# Altium project utca-rtm-template.PrjPcb
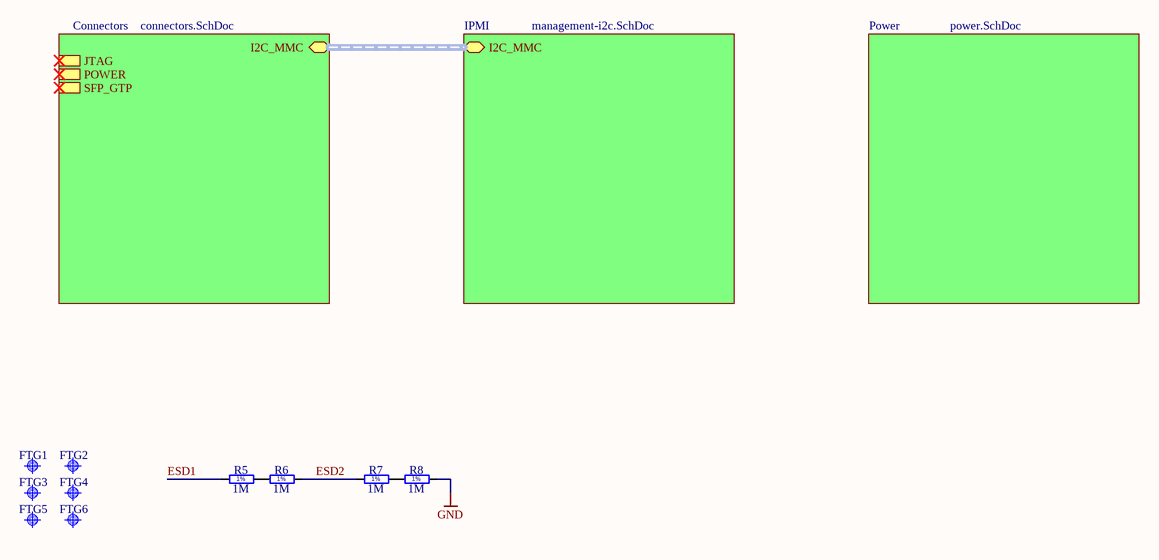
[diagram p0: rtm-top.SchDoc]
4 sheets, 37 parts. Net scope: hierarchical (ports join the sheet entries above them; power ports are global).
Board file: utca-rtm-template.PcbDoc
Sheets:
  rtm-top.SchDoc
    Connectors = connectors.SchDoc
    IPMI = management-i2c.SchDoc
    Power = power.SchDoc

## Sheet rtm-top.SchDoc
size A3

### Parts
FTG1  Use only in PCB  [FIDUCIAL_TOP_C100-200]  (value not drawn)
FTG2  Use only in PCB  [FIDUCIAL_TOP_C100-200]  (value not drawn)
FTG3  Use only in PCB  [FIDUCIAL_TOP_C100-200]  (value not drawn)
FTG4  Use only in PCB  [FIDUCIAL_TOP_C100-200]  (value not drawn)
FTG5  Use only in PCB  [FIDUCIAL_TOP_C100-200]  (value not drawn)
FTG6  Use only in PCB  [FIDUCIAL_TOP_C100-200]  (value not drawn)
R5  1M  [RESC3216X65N]
R6  1M  [RESC3216X65N]
R7  1M  [RESC3216X65N]
R8  1M  [RESC3216X65N]

### Sub-sheets
Connectors = connectors.SchDoc: I2C_MMC (bidir, harness I2C), JTAG (harness RTM_JTAG), POWER (harness POWER), SFP_GTP (harness SFP_GTP)
IPMI = management-i2c.SchDoc: I2C_MMC (bidir)
Power = power.SchDoc: no entries

### Nets
GND: R8.2
ESD1: R5.1
ESD2: R6.2 R7.1
NetR5_2: R5.2 R6.1
NetR7_2: R7.2 R8.1

### Buses and harness runs
harness sheet Connectors/I2C_MMC = sheet IPMI/I2C_MMC

### Notes on the sheet
- Title:
- Date:
- Project:
- Drawn by:
- Time:
- Revised by:
- Sheet
- of
- Grupo de diagnóstico do feixe -
  DIG - LNLS
- Copyright CNPEM 2020.
  This documentation describes Open Hardware and is licensed under the CERN OHL S v2. You may redistribute and modify this documentation under the terms of the CERN OHL S v2. (https://www.ohwr.org/cernohl). This documentation is distributed WITHOUT ANY EXPRESS OR IMPLIED WARRANTY, INCLUDING OF MERCHANTABILITY, SATISFACTORY QUALITY AND FITNESS FOR A PARTICULAR PURPOSE. Please see the CERN OHL S v2 for applicable conditions.
- File:
- (in symbol R1206_1M_1%_0.25W_100PPM) 1%

### Library data of the parts
FTG1-FTG6 = FIDUCIAL_TARGET_C100-200: Fiducial Target; Part Description: Round Fiducial Target, Top Layer, 1.0mm, Top Solder 2.0mm, Keepout =2.0mm; Mounted: No; Part Number: FIDUCIAL_TARGET_C100-200; Component Kind: Standard (No BOM); Component Type: Standard (No BOM); Pin Count: 1; Family: Fiducial; Socket: No; SMD: Yes; Sense: No; Status: None; ComponentHeight: 0mm; HelpURL: Undefined; Author: CERN DEM JLC; CreateDate: 09/02/2010; LatestRevisionDate: 04/04/2012; PackageDescription: Round Fiducial Target, Top Layer, 1.0mm, Top Solder 2.0mm, Keepout =2.0mm
R5-R8 = R1206_1M_1%_0.25W_100PPM: Resistor - 1%; Part Description: General Purpose Thick Film Chip Resistor; Manufacturer: GENERIC; Manufacturer1 Part Number: NRC12F1004TRF; Power: 0.25W; TC: ±100ppm/°C; Part Number: R1206_1M_1%_0.25W_100PPM; Component Kind: Standard; Component Type: Standard; Pin Count: 2; Value: 1M; Status: Preferred; Tolerance: ±1%; Manufacturer Part Number: R1206_1M_1%_0.25W_100PPM; Case: 1206; Mounted: Yes; Sense: No; Socket: No; SMD: Yes; Manufacturer1 Example: NIC COMPONENT; Manufacturer1 ComponentHeight: 0.65mm; HelpURL: \\cern.ch\dfs\Applications\Altium\Datasheets\R1206_NIC_NRC.pdf; Author: CERN DEM JLC; CreateDate: 03/12/2007; LatestRevisionDate: 13/03/2008

## Sheet connectors.SchDoc
size A3
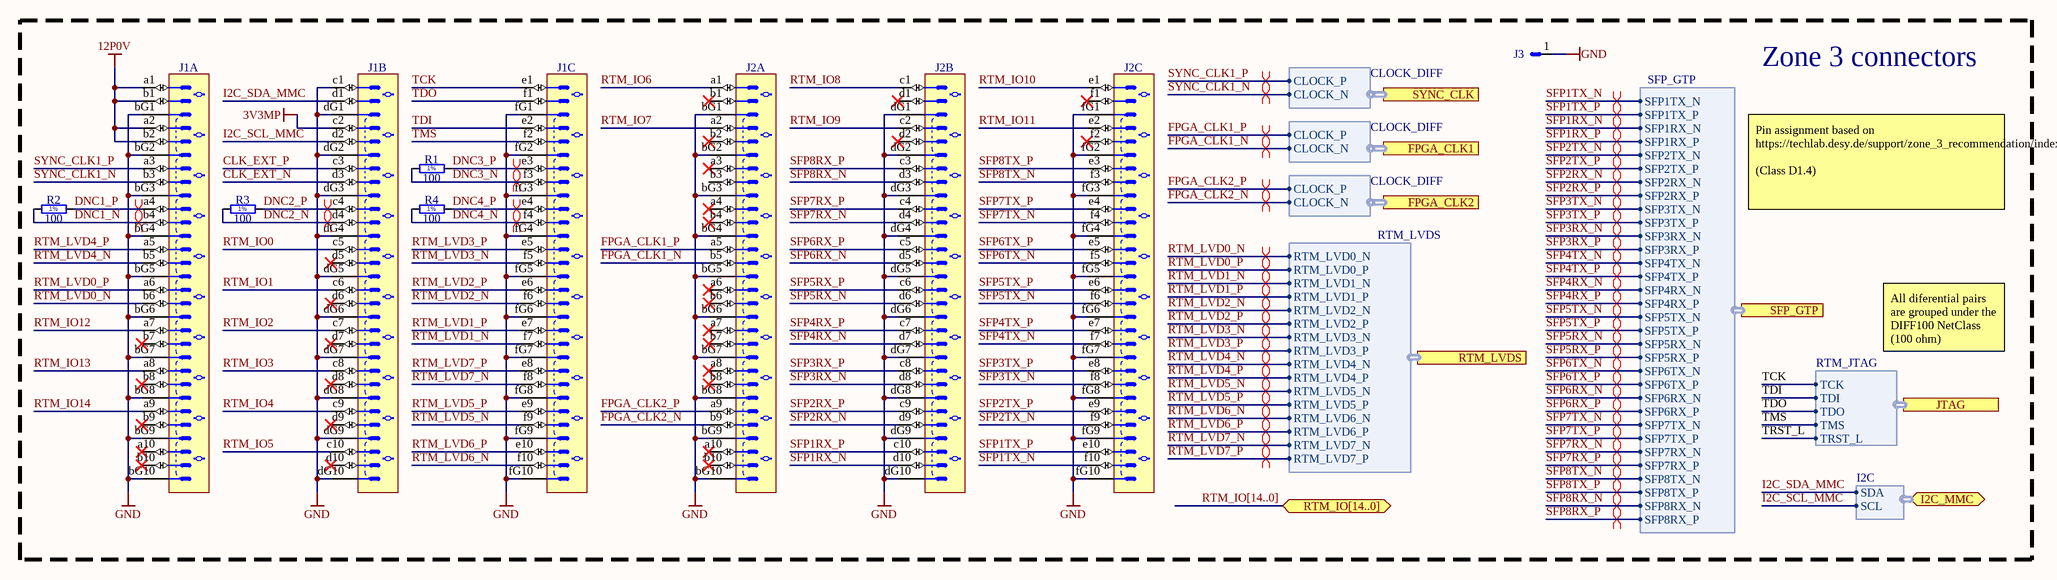
[diagram p1: connectors.SchDoc]

### Parts
J1  Advanced TCA  [TYCO_6469183-1]  (value not drawn)  (parts A,B,C of 3)
J2  Advanced TCA  [TYCO_6469183-1]  (value not drawn)  (parts A,B,C of 3)
J3  (no value)  [TYCO_1469265-1]
R1  100  [RESC1608X55N]
R2  100  [RESC1608X55N]
R3  100  [RESC1608X55N]
R4  100  [RESC1608X55N]

### Blocks framed on the sheet
Zone 3 connectors: J1-J3 R1-R4

### Ports
FPGA_CLK1 (harness CLOCK_DIFF), FPGA_CLK2 (harness CLOCK_DIFF), I2C_MMC (bidir, harness I2C), JTAG (harness RTM_JTAG), RTM_IO[14..0] (bidir, harness JTAG), RTM_LVDS (harness RTM_LVDS), SFP_GTP (harness SFP_GTP), SYNC_CLK (harness CLOCK_DIFF)

### Harnesses
RTM_LVDS: RTM_LVD0_N, RTM_LVD0_P, RTM_LVD1_N, RTM_LVD1_P, RTM_LVD2_N, RTM_LVD2_P, RTM_LVD3_N, RTM_LVD3_P, RTM_LVD4_N, RTM_LVD4_P, RTM_LVD5_N, RTM_LVD5_P, RTM_LVD6_N, RTM_LVD6_P, RTM_LVD7_N, RTM_LVD7_P
SFP_GTP: SFP1RX_N, SFP1RX_P, SFP1TX_N, SFP1TX_P, SFP2TX_N, SFP2TX_P, SFP2RX_N, SFP2RX_P, SFP3TX_N, SFP3TX_P, SFP3RX_N, SFP3RX_P, SFP4TX_N, SFP4TX_P, SFP4RX_N, SFP4RX_P, SFP5TX_N, SFP5TX_P, SFP5RX_N, SFP5RX_P, SFP6TX_N, SFP6TX_P, SFP6RX_N, SFP6RX_P, SFP7TX_N, SFP7TX_P, SFP7RX_N, SFP7RX_P, SFP8TX_N, SFP8TX_P, SFP8RX_N, SFP8RX_P
RTM_JTAG: TCK, TDI, TDO, TMS, TRST_L
CLOCK_DIFF: CLOCK_P, CLOCK_N
I2C: SDA, SCL

### Nets
3V3MP: J1.c2
12P0V: J1.a1 J1.a2 J1.b1 J1.b2
GND: J1.bG1 J1.bG2 J1.bG3 J1.bG4 J1.bG5 J1.bG6 J1.bG7 J1.bG8 J1.bG9 J1.bG10 J1.c1 J1.dG1 J1.dG2 J1.dG3 J1.dG4 J1.dG5 J1.dG6 J1.dG7 J1.dG8 J1.dG9 J1.dG10 J1.fG1 J1.fG2 J1.fG3 J1.fG4 J1.fG5 J1.fG6 J1.fG7 J1.fG8 J1.fG9 J1.fG10 J2.bG1 J2.bG2 J2.bG3 J2.bG4 J2.bG5 J2.bG6 J2.bG7 J2.bG8 J2.bG9 J2.bG10 J2.dG1 J2.dG2 J2.dG3 J2.dG4 J2.dG5 J2.dG6 J2.dG7 J2.dG8 J2.dG9 J2.dG10 J2.fG1 J2.fG2 J2.fG3 J2.fG4 J2.fG5 J2.fG6 J2.fG7 J2.fG8 J2.fG9 J2.fG10 J3.1
CLK_EXT_N: J1.d3
CLK_EXT_P: J1.c3
DNC1_N: J1.b4 R2.1
DNC1_P: J1.a4 R2.2
DNC2_N: J1.d4 R3.1
DNC2_P: J1.c4 R3.2
DNC3_N: J1.f3 R1.1
DNC3_P: J1.e3 R1.2
DNC4_N: J1.f4 R4.1
DNC4_P: J1.e4 R4.2
FPGA_CLK1_N: J2.b5 ; port FPGA_CLK1.CLOCK_N
FPGA_CLK1_P: J2.a5 ; port FPGA_CLK1.CLOCK_P
FPGA_CLK2_N: J2.b9 ; port FPGA_CLK2.CLOCK_N
FPGA_CLK2_P: J2.a9 ; port FPGA_CLK2.CLOCK_P
I2C_SCL_MMC: J1.d2 ; port I2C_MMC.SCL
I2C_SDA_MMC: J1.d1 ; port I2C_MMC.SDA
RTM_IO0: J1.c5
RTM_IO1: J1.c6
RTM_IO2: J1.c7
RTM_IO3: J1.c8
RTM_IO4: J1.c9
RTM_IO5: J1.c10
RTM_IO6: J2.a1
RTM_IO7: J2.a2
RTM_IO8: J2.c1
RTM_IO9: J2.c2
RTM_IO10: J2.e1
RTM_IO11: J2.e2
RTM_IO12: J1.a7
RTM_IO13: J1.a8
RTM_IO14: J1.a9
RTM_LVD0_N: J1.b6 ; port RTM_LVDS.RTM_LVD0_N
RTM_LVD0_P: J1.a6 ; port RTM_LVDS.RTM_LVD0_P
RTM_LVD1_N: J1.f7 ; port RTM_LVDS.RTM_LVD1_N
RTM_LVD1_P: J1.e7 ; port RTM_LVDS.RTM_LVD1_P
RTM_LVD2_N: J1.f6 ; port RTM_LVDS.RTM_LVD2_N
RTM_LVD2_P: J1.e6 ; port RTM_LVDS.RTM_LVD2_P
RTM_LVD3_N: J1.f5 ; port RTM_LVDS.RTM_LVD3_N
RTM_LVD3_P: J1.e5 ; port RTM_LVDS.RTM_LVD3_P
RTM_LVD4_N: J1.b5 ; port RTM_LVDS.RTM_LVD4_N
RTM_LVD4_P: J1.a5 ; port RTM_LVDS.RTM_LVD4_P
RTM_LVD5_N: J1.f9 ; port RTM_LVDS.RTM_LVD5_N
RTM_LVD5_P: J1.e9 ; port RTM_LVDS.RTM_LVD5_P
RTM_LVD6_N: J1.f10 ; port RTM_LVDS.RTM_LVD6_N
RTM_LVD6_P: J1.e10 ; port RTM_LVDS.RTM_LVD6_P
RTM_LVD7_N: J1.f8 ; port RTM_LVDS.RTM_LVD7_N
RTM_LVD7_P: J1.e8 ; port RTM_LVDS.RTM_LVD7_P
SFP1RX_N: J2.d10 ; port SFP_GTP.SFP1RX_N
SFP1RX_P: J2.c10 ; port SFP_GTP.SFP1RX_P
SFP1TX_N: J2.f10 ; port SFP_GTP.SFP1TX_N
SFP1TX_P: J2.e10 ; port SFP_GTP.SFP1TX_P
SFP2RX_N: J2.d9 ; port SFP_GTP.SFP2RX_N
SFP2RX_P: J2.c9 ; port SFP_GTP.SFP2RX_P
SFP2TX_N: J2.f9 ; port SFP_GTP.SFP2TX_N
SFP2TX_P: J2.e9 ; port SFP_GTP.SFP2TX_P
SFP3RX_N: J2.d8 ; port SFP_GTP.SFP3RX_N
SFP3RX_P: J2.c8 ; port SFP_GTP.SFP3RX_P
SFP3TX_N: J2.f8 ; port SFP_GTP.SFP3TX_N
SFP3TX_P: J2.e8 ; port SFP_GTP.SFP3TX_P
SFP4RX_N: J2.d7 ; port SFP_GTP.SFP4RX_N
SFP4RX_P: J2.c7 ; port SFP_GTP.SFP4RX_P
SFP4TX_N: J2.f7 ; port SFP_GTP.SFP4TX_N
SFP4TX_P: J2.e7 ; port SFP_GTP.SFP4TX_P
SFP5RX_N: J2.d6 ; port SFP_GTP.SFP5RX_N
SFP5RX_P: J2.c6 ; port SFP_GTP.SFP5RX_P
SFP5TX_N: J2.f6 ; port SFP_GTP.SFP5TX_N
SFP5TX_P: J2.e6 ; port SFP_GTP.SFP5TX_P
SFP6RX_N: J2.d5 ; port SFP_GTP.SFP6RX_N
SFP6RX_P: J2.c5 ; port SFP_GTP.SFP6RX_P
SFP6TX_N: J2.f5 ; port SFP_GTP.SFP6TX_N
SFP6TX_P: J2.e5 ; port SFP_GTP.SFP6TX_P
SFP7RX_N: J2.d4 ; port SFP_GTP.SFP7RX_N
SFP7RX_P: J2.c4 ; port SFP_GTP.SFP7RX_P
SFP7TX_N: J2.f4 ; port SFP_GTP.SFP7TX_N
SFP7TX_P: J2.e4 ; port SFP_GTP.SFP7TX_P
SFP8RX_N: J2.d3 ; port SFP_GTP.SFP8RX_N
SFP8RX_P: J2.c3 ; port SFP_GTP.SFP8RX_P
SFP8TX_N: J2.f3 ; port SFP_GTP.SFP8TX_N
SFP8TX_P: J2.e3 ; port SFP_GTP.SFP8TX_P
SYNC_CLK1_N: J1.b3 ; port SYNC_CLK.CLOCK_N
SYNC_CLK1_P: J1.a3 ; port SYNC_CLK.CLOCK_P
TCK: J1.e1 ; port JTAG.TCK
TDI: J1.e2 ; port JTAG.TDI
TDO: J1.f1 ; port JTAG.TDO
TMS: J1.f2 ; port JTAG.TMS
TRST_L: port JTAG.TRST_L

Not connected (* = marked no-connect by the designer): J1 a10* b7* b8* b9* b10* d5* d6* d7* d8* d9* d10*; J2 a3* a4* a6* a7* a8* a10* b1* b2* b3 b4* b6* b7* b8* b10* d1* d2* f1* f2*

### Buses and harness runs
bus RTM_IO[14..0]

### Layout directives
differential pair; differential pair class DIFF100: DNC1_N, DNC1_P, DNC2_N, DNC2_P, DNC3_N, DNC3_P, DNC4_N, DNC4_P, FPGA_CLK1_N, FPGA_CLK1_P, FPGA_CLK2_N, FPGA_CLK2_P, RTM_LVD0_N, RTM_LVD0_P, RTM_LVD1_N, RTM_LVD1_P, RTM_LVD2_N, RTM_LVD2_P, RTM_LVD3_N, RTM_LVD3_P, RTM_LVD4_N, RTM_LVD4_P, RTM_LVD5_N, RTM_LVD5_P, RTM_LVD6_N, RTM_LVD6_P, RTM_LVD7_N, RTM_LVD7_P, SFP1RX_N, SFP1RX_P, SFP1TX_N, SFP1TX_P, SFP2RX_N, SFP2RX_P, SFP2TX_N, SFP2TX_P, SFP3RX_N, SFP3RX_P, SFP3TX_N, SFP3TX_P, SFP4RX_N, SFP4RX_P, SFP4TX_N, SFP4TX_P, SFP5RX_N, SFP5RX_P, SFP5TX_N, SFP5TX_P, SFP6RX_N, SFP6RX_P, SFP6TX_N, SFP6TX_P, SFP7RX_N, SFP7RX_P, SFP7TX_N, SFP7TX_P, SFP8RX_N, SFP8RX_P, SFP8TX_N, SFP8TX_P, SYNC_CLK1_N, SYNC_CLK1_P

### Notes on the sheet
- Pin assignment based on https://techlab.desy.de/support/zone_3_recommendation/index_eng.html
  (Class D1.4)
- All diferential pairs are grouped under the DIFF100 NetClass (100 ohm)
- Title:
- Date:
- Project:
- Drawn by:
- Time:
- Revised by:
- Sheet
- of
- Grupo de diagnóstico do feixe -
  DIG - LNLS
- Copyright CNPEM 2020.
  This documentation describes Open Hardware and is licensed under the CERN OHL S v2. You may redistribute and modify this documentation under the terms of the CERN OHL S v2. (https://www.ohwr.org/cernohl). This documentation is distributed WITHOUT ANY EXPRESS OR IMPLIED WARRANTY, INCLUDING OF MERCHANTABILITY, SATISFACTORY QUALITY AND FITNESS FOR A PARTICULAR PURPOSE. Please see the CERN OHL S v2 for applicable conditions.
- File:
- (in symbol R0603_100R_1%_0.1W_100PPM) 1%

### Library data of the parts
J1 J2 = TYCO_6469183-1: Connector 60 ATCA Male 30 Pairs (60 Signals) + 3x10 Ground; Part Description: 60 Positions, Pitch 2.5mm,  Advanced TCA, Z-PACK HM-Zd Right Angle Press Fit Header; Manufacturer: TYCO ELECTRONICS; Part Number: TYCO_6469183-1; Component Kind: Standard; Component Type: Standard; Pin Count: 90; Family: Advanced TCA; Mounted: Yes; Socket: No; SMD: No; PressFit: Yes; Sense: No; Status: None; Manufacturer Part Number: 6469183-1; ComponentHeight: 13.31mm; HelpURL: \\cern.ch\dfs\Applications\Altium\Datasheets\TYCO_6469183-1.pdf; Author: CERN DEM JLC; CreateDate: 28/08/2013; LatestRevisionDate: 28/08/2013
J3 = TYCO_1469265-1: Single Pin Male; Part Description: Universal Right Angle Male Power Module Guide (keyed); Manufacturer: TYCO ELECTRONICS; PressFit: No; Part Number: TYCO_1469265-1; Component Kind: Standard; Component Type: Standard; Pin Count: 1; Mounted: Yes; Socket: No; SMD: No; Sense: No; Status: None; Manufacturer Part Number: 1469265-1; ComponentHeight: 9.78mm; HelpURL: \\cern.ch\dfs\Applications\Altium\Datasheets\TYCO_1469265-1.pdf; Author: CERN DEM JLC; CreateDate: 28/08/2013; LatestRevisionDate: 28/08/2013
R1 R3 R4 = R0603_100R_1%_0.1W_100PPM: Resistor - 1%; Part Description: General Purpose Thick Film Chip Resistor; Manufacturer: GENERIC; Manufacturer1 Part Number: NRC06F4700TRF; Power: 0.1W; TC: ±100ppm/°C; Part Number: R0603_100R_1%_0.1W_100PPM; Component Kind: Standard; Component Type: Standard; Pin Count: 2; Value: 100; Status: Preferred; Tolerance: ±1%; Manufacturer Part Number: R0603_100R_1%_0.1W_100PPM; Case: 0603; Mounted: Yes; Socket: No; SMD: Yes; Manufacturer1 Example: NIC COMPONENT; Manufacturer1 ComponentHeight: 0.55mm; HelpURL: \\cern.ch\dfs\Applications\Altium\Datasheets\R0603_NIC_NRC.pdf; Author: CERN DEM JLC; CreateDate: 03/12/2007; LatestRevisionDate: 13/03/2008; Sense: No
R2 = R0603_100R_1%_0.1W_100PPM: Resistor - 1%; Part Description: General Purpose Thick Film Chip Resistor; Manufacturer: GENERIC; Manufacturer1 Part Number: NRC06F1000TRF; Power: 0.1W; TC: ±100ppm/°C; Part Number: R0603_100R_1%_0.1W_100PPM; Component Kind: Standard; Component Type: Standard; Pin Count: 2; Value: 100; Status: Preferred; Tolerance: ±1%; Manufacturer Part Number: R0603_100R_1%_0.1W_100PPM; Case: 0603; Mounted: Yes; Sense: No; Socket: No; SMD: Yes; Manufacturer1 Example: NIC COMPONENT; Manufacturer1 ComponentHeight: 0.55mm; HelpURL: \\cern.ch\dfs\Applications\Altium\Datasheets\R0603_NIC_NRC.pdf; Author: CERN DEM JLC; CreateDate: 03/12/2007; LatestRevisionDate: 13/03/2008

## Sheet management-i2c.SchDoc
size A3
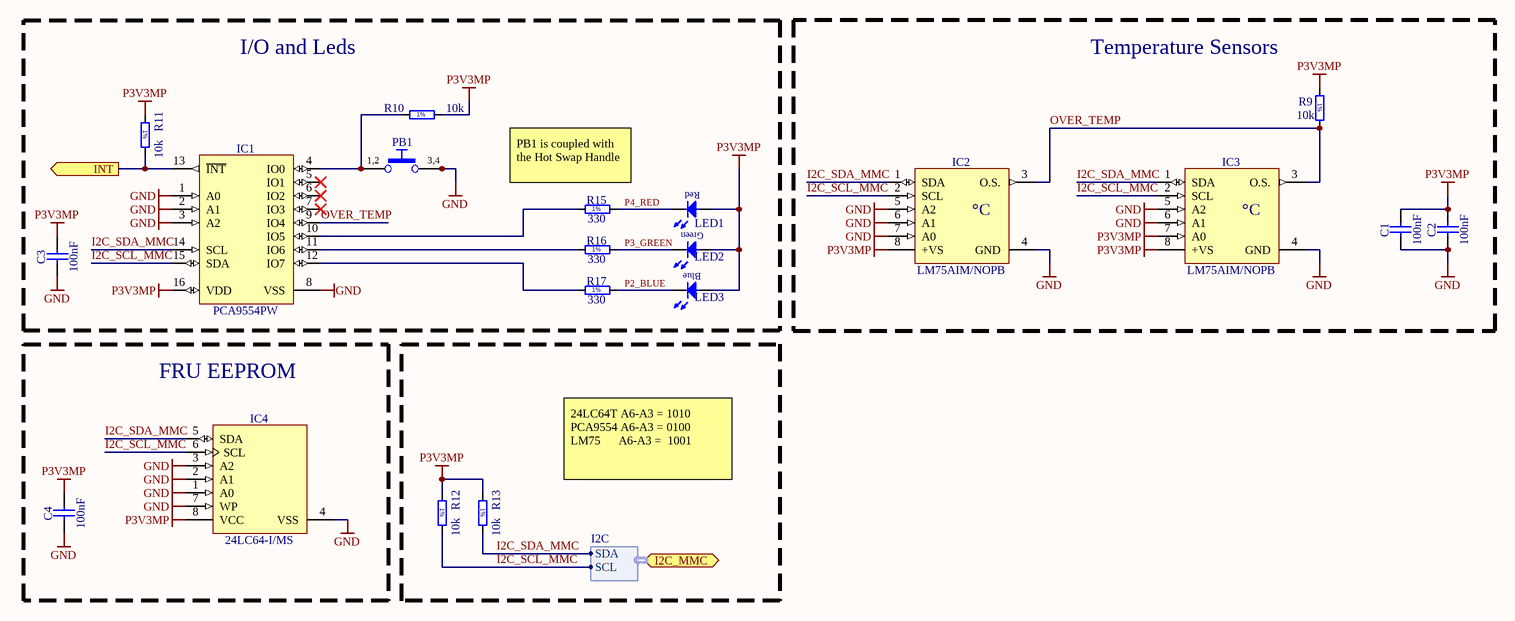
[diagram p2: management-i2c.SchDoc]

### Parts
C1  100nF  [CAPC1005X55N]
C2  100nF  [CAPC1005X55N]
C3  100nF  [CAPC1005X55N]
C4  100nF  [CAPC1005X55N]
IC1  PCA9554PW  [SOP65P640X110-16N]
IC2  LM75AIM/NOPB  [SOIC127P600X175-8N]
IC3  LM75AIM/NOPB  [SOIC127P600X175-8N]
IC4  24LC64-I/MS  [SOP65P490X110-8N]
LED1  Red  [LEDC1608X80N_RED]  (value not drawn)
LED2  Green  [LED_AVAGO_HSME-C120]  (value not drawn)
LED3  Blue  [LED_AVAGO_HSMR-C120]  (value not drawn)
PB1  Push Button  [SW_C&K_HDT0001]  (value not drawn)
R9  10k  [RESC1005X40N]
R10  10k  [RESC1005X40N]
R11  10k  [RESC1005X40N]
R12  10k  [RESC1005X40N]
R13  10k  [RESC1005X40N]
R15  330  [RESC1608X55N]
R16  330  [RESC1608X55N]
R17  330  [RESC1608X55N]

### Blocks framed on the sheet
I/O and Leds: C3 IC1 LED1-LED3 PB1 R10 R11 R15-R17
Temperature Sensors: C1 C2 IC2 IC3 R9
FRU EEPROM: C4 IC4

### Ports
I2C_MMC (bidir, harness I2C), INT (out)

### Harnesses
I2C: SDA, SCL

### Nets
GND: C1.2 C2.2 C3.2 C4.2 IC1.1(A0) IC1.2(A1) IC1.3(A2) IC1.8(VSS) IC2.4(GND) IC2.5(A2) IC2.6(A1) IC2.7(A0) IC3.4(GND) IC3.5(A2) IC3.6(A1) IC4.1(A0) IC4.2(A1) IC4.3(A2) IC4.4(VSS) IC4.7(WP) PB1.3 PB1.4
P3V3MP: C1.1 C2.1 C3.1 C4.1 IC1.16(VDD) IC2.8(+VS) IC3.7(A0) IC3.8(+VS) IC4.8(VCC) LED1.2(A) LED2.2(A) LED3.2(A) R9.1 R10.2 R11.1 R12.1 R13.1
I2C_SCL_MMC: IC1.15(SDA) IC2.2(SCL) IC3.2(SCL) IC4.6(SCL) R12.2 ; port I2C_MMC.SCL
I2C_SDA_MMC: IC1.14(SCL) IC2.1(SDA) IC3.1(SDA) IC4.5(SDA) R13.2 ; port I2C_MMC.SDA
OVER_TEMP: IC1.9(IO4) IC2.3(O.S.) IC3.3(O.S.) R9.2
P2_BLUE: LED3.1(C) R17.2
P3_GREEN: LED2.1(C) R16.2
P4_RED: LED1.1(C) R15.2
NetIC1_4: IC1.4(IO0) PB1.1 PB1.2 R10.1
NetIC1_10: IC1.10(IO5) R15.1
NetIC1_11: IC1.11(IO6) R16.1
NetIC1_12: IC1.12(IO7) R17.1
NetIC1_13: IC1.13(~{INT}) R11.2 ; port INT

Not connected (* = marked no-connect by the designer): IC1 5(IO1)* 6(IO2)* 7(IO3)*

### Notes on the sheet
- (near R15) PB1 is coupled with the Hot Swap Handle
- 24LC64T A6-A3 = 1010
  PCA9554 A6-A3 = 0100
  LM75      A6-A3 =  1001
- Title:
- Date:
- Project:
- Drawn by:
- Time:
- Revised by:
- Sheet
- of
- Grupo de diagnóstico do feixe -
  DIG - LNLS
- Copyright CNPEM 2020.
  This documentation describes Open Hardware and is licensed under the CERN OHL S v2. You may redistribute and modify this documentation under the terms of the CERN OHL S v2. (https://www.ohwr.org/cernohl). This documentation is distributed WITHOUT ANY EXPRESS OR IMPLIED WARRANTY, INCLUDING OF MERCHANTABILITY, SATISFACTORY QUALITY AND FITNESS FOR A PARTICULAR PURPOSE. Please see the CERN OHL S v2 for applicable conditions.
- File:
- (in symbol LM75AIM/NOPB) °C
- (in symbol R0402_10K_1%_0.0625W_100PPM) 1%
- (in symbol R0603_330R_1%_0.1W_100PPM) 1%
- (in symbol SW_C&K_HDT0001) 1,2; 3,4

### Library data of the parts
C1-C4 = CC0402_100NF_16V_10%_X7R: Non-polarised capacitor; Part Description: SMD Multilayer Chip Ceramic Capacitor; Manufacturer: GENERIC; Manufacturer1 Part Number: 223878715649; Voltage: 16V; TC: X7R; Tolerance: ±10%; Table: Capacitors SMD; Part Number: CC0402_100NF_16V_10%_X7R; Component Kind: Standard; Component Type: Standard; Pin Count: 2; Value: 100nF; Status: Not Recommended; Manufacturer Part Number: CC0402_100NF_16V_10%_X7R; Case: 0402; Mounted: Yes; Socket: No; SMD: Yes; Manufacturer1 Example: PHYCOMP; Manufacturer1 ComponentHeight: 0.55mm; HelpURL: \\cern.ch\dfs\Applications\Altium\Datasheets\CC0402_X7R_PHYCOMP.pdf; Author: CERN DEM JLC; CreateDate: 12/3/2007; LatestRevisionDate: 12/3/2007
IC1 = PCA9554PW: 8-Bit I2C-Bus and SMBus I/O Port with Interrupt; Manufacturer: NXP SEMICONDUCTORS; PressFit: No; Bonding: No; Part Number: PCA9554PW; Component Kind: Standard; Component Type: Standard; Device: PCA9554PW; PackageDescription: SOP, 0.65mm pitch; 16 pin, 4.40mm W X 5.00mm L X 1.10mm H body IPC Medium Density; Part Description: 8-Bit I2C-Bus and SMBus I/O Port with Interrupt; Manufacturer Part Number: PCA9554PW; Pin Count: 16; Case: TSSOP16; Mounted: Yes; Socket: No; SMD: Yes; Sense: No; ComponentHeight: 1.1mm; Author: CERN DEM JLC; HelpURL: \\cern.ch\dfs\Applications\Altium\Datasheets\PCA9554PW.pdf; CreateDate: 04/11/2014; LatestRevisionDate: 04/11/2014
IC2 IC3 = LM75AIM/NOPB: Digital Temperature Sensor and Thermal Watchdog with Two-Wire Interface; Part Description: -25° to +100°C ±2°C Digital Temperature Sensor and Thermal Watchdog with Two-Wire Interface; Manufacturer: TEXAS INSTRUMENTS; PressFit: No; Bonding: No; Part Number: LM75AIM/NOPB; Component Kind: Standard; Component Type: Standard; Device: LM75AIM/NOPB; PackageDescription: SOIC 8, Pitch 1.27mm - Body 4x5mm, IPC Medium Density; Manufacturer Part Number: LM75AIM/NOPB; Pin Count: 8; Case: SOIC8; Mounted: Yes; Socket: No; SMD: Yes; Sense: No; ComponentHeight: 1.75mm; HelpURL: \\cern.ch\dfs\Applications\Altium\Datasheets\LM75AIM-NOPB.pdf; Author: CERN DEM JLC; CreateDate: 15/10/2012; LatestRevisionDate: 15/10/2012
IC4 = 24LC64-I/MS: 64K I2C Serial EEPROM; Part Description: 2.5V-5.5V, 64K (8K x 8-bit) I2C Serial EEPROM; Manufacturer: MICROCHIP TECHNOLOGY; Table: Logic; Part Number: 24LC64-I/MS; Component Kind: Standard; Component Type: Standard; Device: 24LC64-I/MS; PackageDescription: SOP, 0.65mm pitch; 8 pin, 3.00mm W X 3.00mm L X 1.10mm H body, IPC Medium Density; Manufacturer Part Number: 24LC64-I/MS; Pin Count: 8; Case: MSOP8; Mounted: Yes; Socket: No; SMD: Yes; ComponentHeight: 1.1mm; HelpURL: \\cern.ch\dfs\Applications\Altium\Datasheets\24LC64-I-MS.pdf; Author: CERN DEM JLC; CreateDate: 2011-01-24; LatestRevisionDate: 2011-01-24
LED1 = LED_ROHM_SML-311UTT86K: LED Red 1C 2A; Part Description: Low current chip LED SML-311 Serie; Manufacturer: ROHM; PressFit: No; Bonding: No; Part Number: LED_ROHM_SML-311UTT86K; Component Kind: Standard; Component Type: Standard; Color: Red; PackageDescription: Chip Red LED, 2-Leads, Body 1.6x0.8mm, IPC Medium Density; Manufacturer Part Number: SML-311UTT86K; Pin Count: 2; Mounted: Yes; Socket: No; SMD: Yes; Sense: No; ComponentHeight: 0.8mm; HelpURL: \\cern.ch\dfs\Applications\Altium\Datasheets\LED_ROHM_SML-311UTT86K.pdf; Author: CERN DEM JLC; CreateDate: 16/03/2010; LatestRevisionDate: 17/03/2010
LED2 = LED_AVAGO_HSME-C120: LED Green 1C 2A; Part Description: High Performance Right Angle Chip Green LED; Manufacturer: AVAGO TECHNOLOGIES; PressFit: No; Bonding: No; Part Number: LED_AVAGO_HSME-C120; Component Kind: Standard; Component Type: Standard; Color: Green; PackageDescription: Green Chip LED, 2-Leads, Body 1.7x1.1mm, Side Emitting Package; Manufacturer Part Number: HSME-C120; Pin Count: 2; Mounted: Yes; Socket: No; SMD: Yes; Sense: No; ComponentHeight: 0.7mm; HelpURL: \\cern.ch\dfs\Applications\Altium\Datasheets\LED_AVAGO_HSME-C120.pdf; ComponentLink1URL: \\cern.ch\dfs\Applications\Altium\Datasheets\LED_AVAGO_HSME-C110_DESIGN-GUIDE.pdf; ComponentLink1Description: Design Guide; Author: CERN DEM JMW; CreateDate: 22/07/2009; LatestRevisionDate: 20/06/2012
LED3 = LED_AVAGO_HSMR-C120: LED Blue 1C 2A; Part Description: High Performance Right Angle Chip InGaN Blue LED; Manufacturer: AVAGO TECHNOLOGIES; PressFit: No; Bonding: No; Part Number: LED_AVAGO_HSMR-C120; Component Kind: Standard; Component Type: Standard; Color: Blue; Footprint: LED_AVAGO_HSME-C120; PackageDescription: Blue Chip LED, 2-Leads, Body 1.7x1.1mm, Side Emitting Package; Manufacturer Part Number: HSMR-C120; Pin Count: 2; Mounted: Yes; Socket: No; SMD: Yes; Sense: No; ComponentHeight: 0.7mm; HelpURL: \\cern.ch\dfs\Applications\Altium\Datasheets\LED_AVAGO_HSMR-C120.pdf; Author: CERN DEM JLC; CreateDate: 07/07/2014; LatestRevisionDate: 07/07/2014
PB1 = SW_C&K_HDT0001: Push-Button Switch SPDT; Part Description: 5VDC 1mA SPST-NO Micro Mini Surface Surface Mount Detect Push-Button Switch, HDT Serie; Manufacturer: C&K; Table: Switches; Part Number: SW_C&K_HDT0001; Component Kind: Standard; Component Type: Standard; Pin Count: 4; PackageDescription: Body 3.5x2.8mm, Micro Mini Surface Mount Detect Switches, HDT Serie; Family: Push Button; Mounted: Yes; Socket: No; SMD: Yes; Status: None; Manufacturer Part Number: HDT0001; ComponentHeight: 3.35mm; HelpURL: \\cern.ch\dfs\Applications\Altium\Datasheets\SW_C&K_HDT0001.pdf; Author: CERN DEM JLC; CreateDate: 2012-08-15; LatestRevisionDate: 2012-08-15
R9-R13 = R0402_10K_1%_0.0625W_100PPM: Resistor - 1%; Part Description: General Purpose Thick Film Chip Resistor; Manufacturer: GENERIC; Manufacturer1 Part Number: 232270671003L; TC: ±100ppm/°C; Table: Resistors SMD; Part Number: R0402_10K_1%_0.0625W_100PPM; Component Kind: Standard; Component Type: Standard; Pin Count: 2; Value: 10k; Status: Not recommended; Power: 0.0625W; Tolerance: ±1%; Manufacturer Part Number: R0402_10K_1%_0.0625W_100PPM; Case: 0402; Mounted: Yes; Socket: No; SMD: Yes; Manufacturer1 Example: YAGEO PHYCOMP; Manufacturer1 ComponentHeight: 0.4mm; HelpURL: \\cern.ch\dfs\Applications\Altium\Datasheets\R0402_Phycomp_RC0402.pdf; Author: CERN DEM JLC; CreateDate: 2007-12-03; LatestRevisionDate: 2012-10-17
R15-R17 = R0603_330R_1%_0.1W_100PPM: Resistor - 1%; Part Description: General Purpose Thick Film Chip Resistor; Manufacturer: GENERIC; Manufacturer1 Part Number: NRC06F3300TRF; Power: 0.1W; TC: ±100ppm/°C; Table: Resistors SMD; Part Number: R0603_330R_1%_0.1W_100PPM; Component Kind: Standard; Component Type: Standard; Pin Count: 2; Value: 330; Status: Preferred; Tolerance: ±1%; Manufacturer Part Number: R0603_330R_1%_0.1W_100PPM; Case: 0603; Mounted: Yes; Socket: No; SMD: Yes; Manufacturer1 Example: NIC COMPONENT; Manufacturer1 ComponentHeight: 0.55mm; HelpURL: \\cern.ch\dfs\Applications\Altium\Datasheets\R0603_NIC_NRC.pdf; Author: CERN DEM JLC; CreateDate: 2007-12-03; LatestRevisionDate: 2008-03-13

## Sheet power.SchDoc
size A3

### Notes on the sheet
- Title:
- Date:
- Project:
- Drawn by:
- Time:
- Revised by:
- Sheet
- of
- Grupo de diagnóstico do feixe -
  DIG - LNLS
- Copyright CNPEM 2020.
  This documentation describes Open Hardware and is licensed under the CERN OHL S v2. You may redistribute and modify this documentation under the terms of the CERN OHL S v2. (https://www.ohwr.org/cernohl). This documentation is distributed WITHOUT ANY EXPRESS OR IMPLIED WARRANTY, INCLUDING OF MERCHANTABILITY, SATISFACTORY QUALITY AND FITNESS FOR A PARTICULAR PURPOSE. Please see the CERN OHL S v2 for applicable conditions.
- File:

## Nets that join several sheets
GND: rtm-top (R8.2), connectors (62 pins), management-i2c (22 pins)
I2C_SCL_MMC: connectors (J1.d2), management-i2c (5 pins)
I2C_SDA_MMC: connectors (J1.d1), management-i2c (5 pins)